# EAGLE schematic Control Board v0.1 (EAGLE 7.7.0)
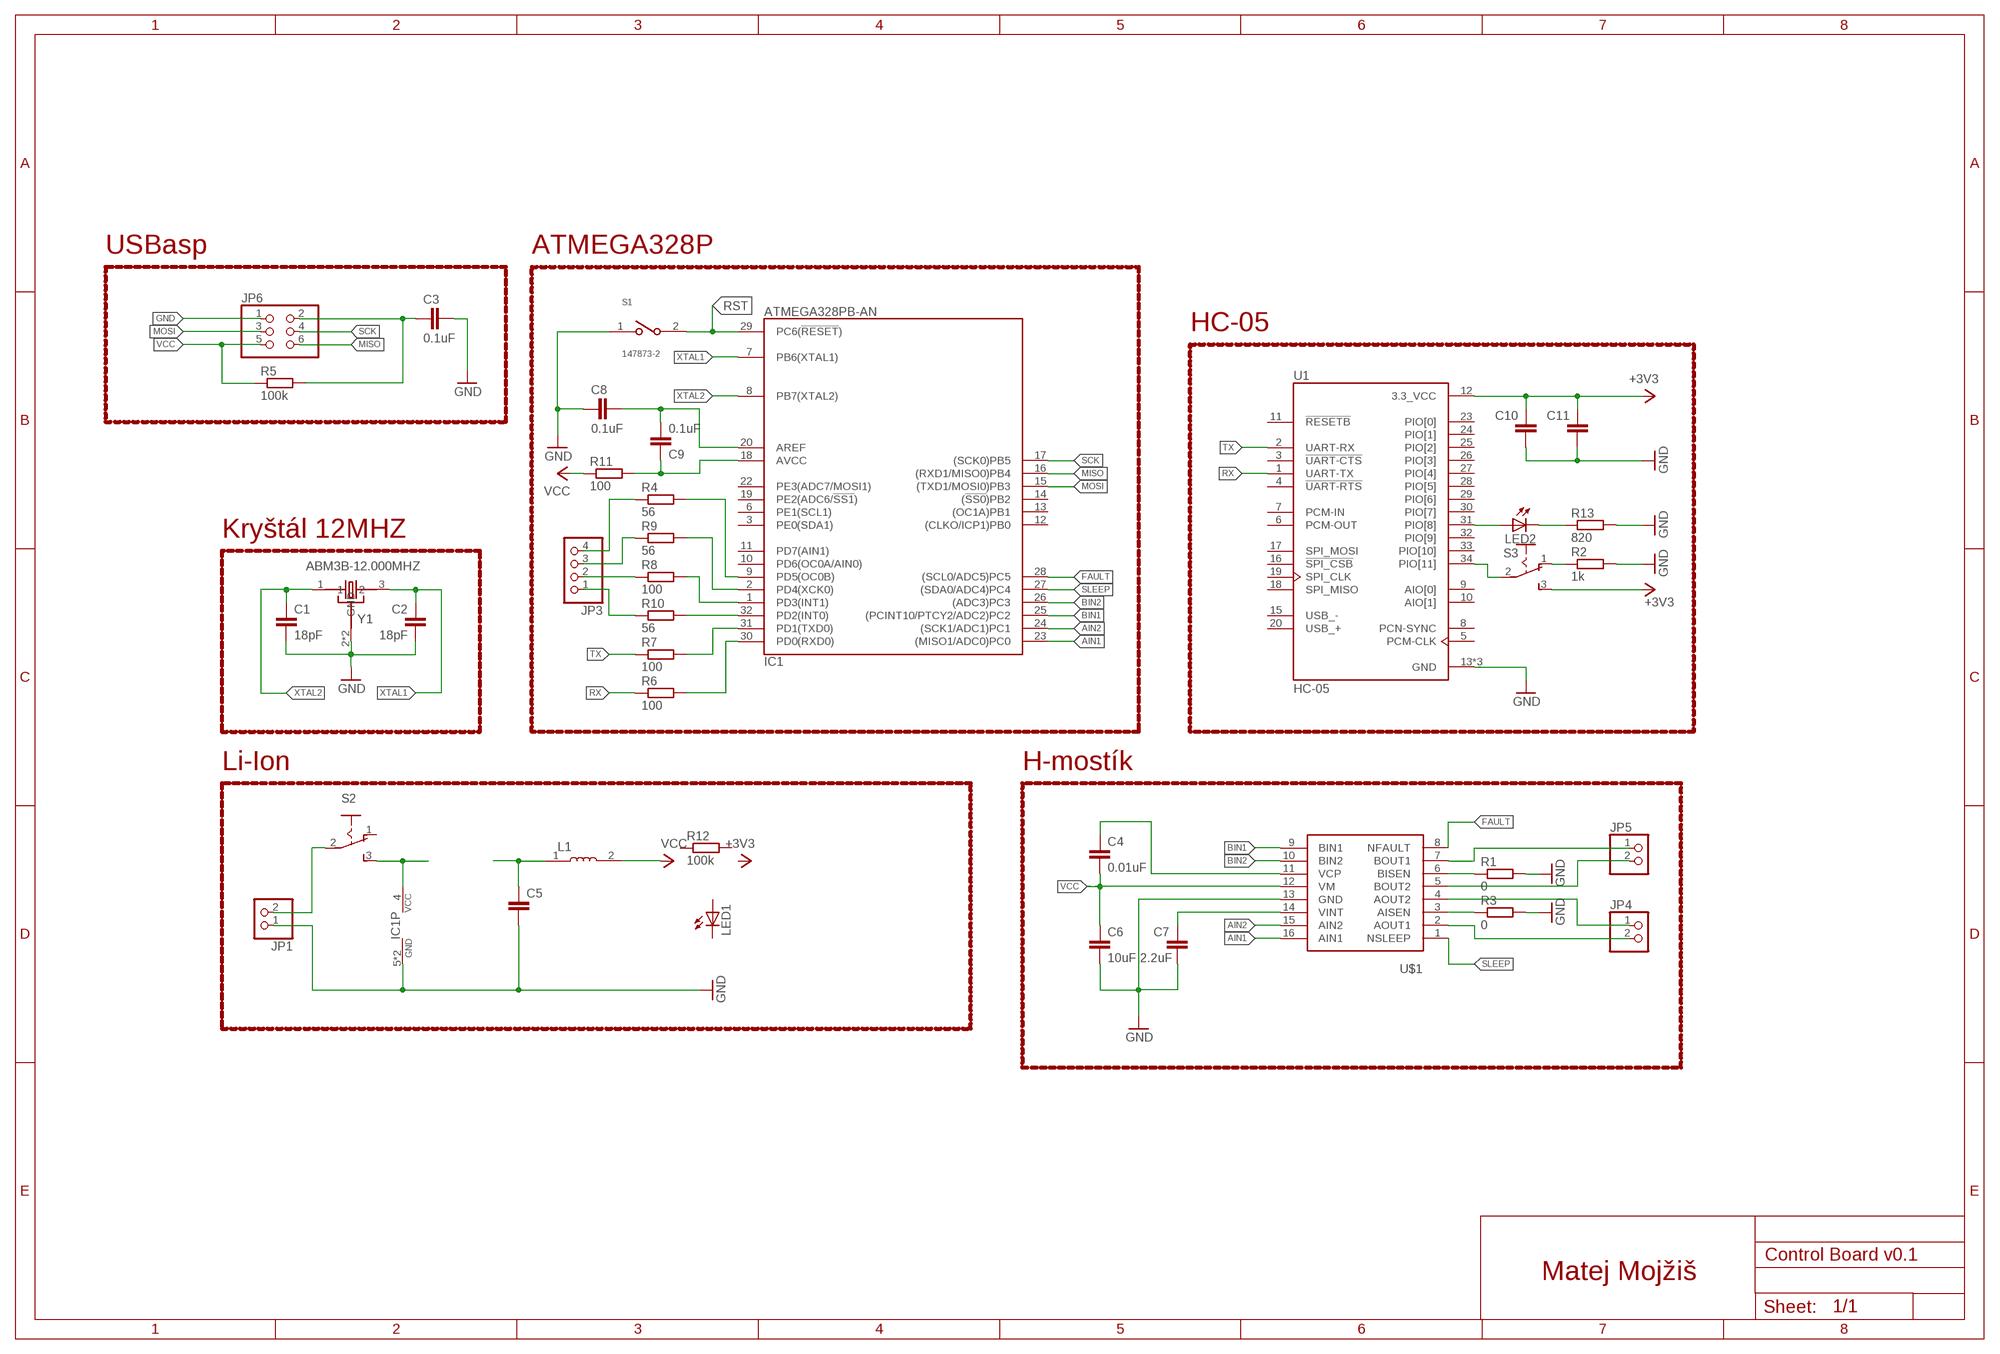
[diagram p0: schematic, sheet 1]

## Parts
C1  18pF  C-EUC0805  [C0805]
C2  18pF  C-EUC0805  [C0805]
C3  0.1uF  C-EUC0805  [C0805]
C4  0.01uF  C-EUC0805  [C0805]
C5  C-EUC0805  [C0805]
C6  10uF  C-EUC0805  [C0805]
C7  2.2uF  C-EUC0805  [C0805]
C8  0.1uF  C-EUC0805  [C0805]
C9  0.1uF  C-EUC0805  [C0805]
C10  C-EUC0805  [C0805]
C11  C-EUC0805  [C0805]
IC1  ATMEGA328PB-AN  [QFP32_7X7_0.80]
JP1  PINHD-1X2/90  [1X02/90]
JP3  PINHD-1X4  [1X04]
JP4  PINHD-1X2/90  [1X02/90]
JP5  PINHD-1X2/90  [1X02/90]
JP6  PINHD-2X3  [2X03]
L1  MLF2012C330KT000  [INDC2012X87N]
LED1  LEDCHIPLED_0805  [CHIPLED_0805]
LED2  LEDCHIPLED_0805  [CHIPLED_0805]
R1  0  R-EU_R0805  [R0805]
R2  1k  R-EU_R0805  [R0805]
R3  0  R-EU_R0805  [R0805]
R4  56  R-EU_R0805  [R0805]
R5  100k  R-EU_R0805  [R0805]
R6  100  R-EU_R0805  [R0805]
R7  100  R-EU_R0805  [R0805]
R8  100  R-EU_R0805  [R0805]
R9  56  R-EU_R0805  [R0805]
R10  56  R-EU_R0805  [R0805]
R11  100  R-EU_R0805  [R0805]
R12  100k  R-EU_R0805  [R0805]
R13  820  R-EU_R0805  [R0805]
S1  147873-2  [SW_147873-2]
S2  255SB  [255SB]
S3  M251  [M251]
U1  HC-05  [XCVR_HC-05]
U$1  DVR8833SUPERFICIAL  [PWP16]
Y1  ABM3B-12.000MHZ  ABM3B-8.000MHZ-B2-T  [OSCSC500X320X110-4N]

## Nets
+3V3: C10.1 C11.1 S3.3(S) U1.12(3.3_VCC)
AIN1: IC1.23((MISO1/ADC0)PC0) U$1.16(AIN1)
AIN2: IC1.24((SCK1/ADC1)PC1) U$1.15(AIN2)
BIN1: IC1.25((PCINT10/PTCY2/ADC2)PC2) U$1.9(BIN1)
BIN2: IC1.26((ADC3)PC3) U$1.10(BIN2)
FAULT: IC1.28((SCL0/ADC5)PC5) U$1.8(NFAULT)
GND: C1.2 C2.2 C3.1 C5.2 C6.2 C7.2 C8.2 C10.2 C11.2 IC1.5(GND) IC1.21(GND) JP1.1 JP6.1 R1.2 R2.2 R3.2 R13.2 S1.1 U1.13(GND) U1.21(GND) U1.22(GND) U$1.13(GND) Y1.2(GND) Y1.4(GND)
MISO: IC1.16((RXD1/MISO0)PB4) JP6.6
MOSI: IC1.15((TXD1/MOSI0)PB3) JP6.3
N$1: IC1.4(VCC) S2.3(S)
N$2: IC1.31(PD1(TXD0)) R7.2
N$3: JP1.2 S2.2(P)
N$4: JP5.1 U$1.7(BOUT1)
N$5: IC1.30(PD0(RXD0)) R6.2
N$6: IC1.32(PD2(INT0)) R10.2
N$7: JP5.2 U$1.5(BOUT2)
N$8: JP4.1 U$1.4(AOUT2)
N$9: JP4.2 U$1.2(AOUT1)
N$10: R1.1 U$1.6(BISEN)
N$11: R3.1 U$1.3(AISEN)
N$12: LED2.A U1.31(PIO[8])
N$13: C4.1 U$1.11(VCP)
N$14: LED2.C R13.1
N$15: C7.1 U$1.14(VINT)
N$18: IC1.1(PD3(INT1)) R8.2
N$19: S3.2(P) U1.34(PIO[11])
N$20: R2.1 S3.1(O)
N$21: C5.1 L1.1
N$22: IC1.2(PD4(XCK0)) R9.2
N$23: IC1.9(PD5(OC0B)) R4.2
N$24: JP3.4 R4.1
N$25: JP3.1 R10.1
N$26: JP3.2 R8.1
N$27: JP3.3 R9.1
N$28: C8.1 C9.2 IC1.20(AREF)
N$30: C9.1 IC1.18(AVCC) R11.2
RST: C3.2 IC1.29(PC6(!RESET!)) JP6.2 R5.2 S1.2
RX: R6.1 U1.1(UART-TX)
SCK: IC1.17((SCK0)PB5) JP6.4
SLEEP: IC1.27((SDA0/ADC4)PC4) U$1.1(NSLEEP)
TX: R7.1 U1.2(UART-RX)
VCC: C4.2 C6.1 JP6.5 L1.2 R5.1 R11.1 U$1.12(VM)
XTAL1: C2.1 IC1.7(PB6(XTAL1)) Y1.3
XTAL2: C1.1 IC1.8(PB7(XTAL2)) Y1.1
Unconnected: IC1.3(PE0(SDA1)) IC1.6(PE1(SCL1)) IC1.10(PD6(OC0A/AIN0)) IC1.11(PD7(AIN1)) IC1.12((CLKO/ICP1)PB0) IC1.13((OC1A)PB1) IC1.14((!SS0!)PB2) IC1.19(PE2(ADC6/!SS1!)) IC1.22(PE3(ADC7/MOSI1)) LED1.A LED1.C R12.1 R12.2 S2.1(O) U1.3(!UART-CTS) U1.4(!UART-RTS) U1.5(PCM-CLK) U1.6(PCM-OUT) U1.7(PCM-IN) U1.8(PCN-SYNC) U1.9(AIO[0]) U1.10(AIO[1]) U1.11(!RESETB) U1.15(USB_-) U1.16(!SPI_CSB) U1.17(SPI_MOSI) U1.18(SPI_MISO) U1.19(SPI_CLK) U1.20(USB_+) U1.23(PIO[0]) U1.24(PIO[1]) U1.25(PIO[2]) U1.26(PIO[3]) U1.27(PIO[4]) U1.28(PIO[5]) U1.29(PIO[6]) U1.30(PIO[7]) U1.32(PIO[9]) U1.33(PIO[10])

## Notes on the sheet
- USBasp | ATMEGA328P
- HC-05
- Kryštál 12MHZ
- Li-Ion | H-mostík
- Matej Mojžiš

## Library data of the parts
C1-C11 = rcl:C-EU: CAPACITOR, European symbol
IC1 = atmel328new:ATMEGA328PB: 8-bit AVR Microcontroller 32kbytes flash 2kbytes SRAM 1kbyte EEPROM USART 8-channel 10 bit ADC
JP1 JP4 JP5 = pinhead:PINHD-1X2: PIN HEADER
JP3 = pinhead:PINHD-1X4: PIN HEADER
JP6 = pinhead:PINHD-2X3: PIN HEADER
L1 = MLF2012C330KT000:MLF2012C330KT000: FIXED IND 33UH 5MA 1.1 OHM SMD Check prices <https://pricing.snapeda.com/parts/MLF2012C330KT000/TDK/view-part?ref=eda>; AVAILABILITY: Warning; DESCRIPTION: Fixed Ind 33uh 5ma 1.1 Ohm Smd; MF: TDK; MP: MLF2012C330KT000; PACKAGE: 0805 TDK; PRICE: None; PURCHASE-URL: https://pricing.snapeda.com/search/part/MLF2012C330KT000/?ref=eda
LED1 LED2 = led:LED: LED OSRAM: - CHIPLED LG R971, LG N971, LY N971, LG Q971, LY Q971, LO R971, LY R971 LH N974, LH R974 LS Q976, LO Q976, LY Q976 LO Q996 - Hyper CHIPLED LW Q18S LB Q993, LB Q99A, LB R99A - SideLED LS A670, LO A670, LY A670, LG A670, LP A670 LB A673, LV A673, LT A673, LW A673 LH A674 LY A675 LS A676, LA A676, LO A676, LY A676, LW A676 LS A679, LY A679, LG A679 - Hyper Micro SIDELED® LS Y876, LA Y876, LO Y876, LY Y876 LT Y87S - SmartLED LW L88C, LW L88S LB L89C, LB L89S, LG L890 LS L89K, LO L89K, LY L89K LS L896, LA L896, LO L896, LY L896 - TOPLED LS T670, LO T670, LY T670, LG T670, LP T670 LSG T670, LSP T670, LSY T670, LOP T670, LYG T670 LG T671, LOG T671, LSG T671 LB T673, LV T673, LT T673, LW T673 LH T674 LS T676, LA T676, LO T676, LY T676, LB T676, LH T676, LSB T676, LW T676 LB T67C, LV T67C, LT T67C, LS T67K, LO T67K, LY T67K, LW E67C LS E67B, LA E67B, LO E67B, LY E67B, LB E67C, LV E67C, LT E67C LW T67C LS T679, LY T679, LG T679 LS T770, LO T770, LY T770, LG T770, LP T770 LB T773, LV T773, LT T773, LW T773 LH T774 LS E675, LA E675, LY E675, LS T675 LS T776, LA T776, LO T776, LY T776, LB T776 LHGB T686 LT T68C, LB T68C - Hyper Mini TOPLED® LB M676 - Mini TOPLED Santana® LG M470 LS M47K, LO M47K, LY M47K Source: http://www.osram.convergy.de LUXEON: - LUMILED® LXK2-PW12-R00, LXK2-PW12-S00, LXK2-PW14-U00, LXK2-PW14-V00 LXK2-PM12-R00, LXK2-PM12-S00, LXK2-PM14-U00 LXK2-PE12-Q00, LXK2-PE12-R00, LXK2-PE12-S00, LXK2-PE14-T00, LXK2-PE14-U00 LXK2-PB12-K00, LXK2-PB12-L00, LXK2-PB12-M00, LXK2-PB14-N00, LXK2-PB14-P00, LXK2-PB14-Q00 LXK2-PR12-L00, LXK2-PR12-M00, LXK2-PR14-Q00, LXK2-PR14-R00 LXK2-PD12-Q00, LXK2-PD12-R00, LXK2-PD12-S00 LXK2-PH12-R00, LXK2-PH12-S00 LXK2-PL12-P00, LXK2-PL12-Q00, LXK2-PL12-R00 Source: www.luxeon.com KINGBRIGHT: KA-3528ASYC Source: www.kingbright.com
R1-R13 = rcl:R-EU_: RESISTOR, European symbol
S1 = 147873-2:147873-2: SWITCH TACTILE SPST-NO 0.05A 24V Check prices <https://pricing.snapeda.com/parts/147873-2/TE%20Connectivity/view-part?ref=eda>; AVAILABILITY: Good; COMMENT: 147873-2; CONFIGURATION_POLE-THROW: Single Pole - Single Throw; CONTACT_CURRENT_RATING: 50 mA; DESCRIPTION: Switch Tactile OFF (ON) SPST Rectangular Button J-Bend 0.05A 24VDC 1.77N SMD T/R; MF: TE Connectivity; MP: 147873-2; PACKAGE: None; PRICE: None; PURCHASE-URL: https://pricing.snapeda.com/search/part/147873-2/?ref=eda
S2 = switch:255SB: SLIDING SWITCH Distributor Buerklin, 11G810
S3 = switch:M251: SLIDING SWITCH Mors, distributor Buerklin, 11G702
U1 = HC-05:HC-05: Bluetooth to Serial Port Module; AVAILABILITY: Unavailable; DESCRIPTION: Bluetooth to Serial Port Module; MF: Bel Power solution; MP: HC-05; PACKAGE: SOIC-14; PRICE: None
U$1 = personales:DVR8833
Y1 = ABM3B-8.000MHZ-B2-T:ABM3B-8.000MHZ-B2-T: Crystal 8MHz ±20ppm (Tol) ±50ppm (Stability) 18pF FUND 200Ohm 4-Pin CSMD T/R Check prices <https://pricing.snapeda.com/parts/ABM3B-8.000MHZ-B2-T/Abracon/view-part?ref=eda>; AVAILABILITY: Good; DESCRIPTION: 8MHz ±20ppm Crystal 18pF 200 Ohms 4-SMD, No Lead; MF: Abracon; MP: ABM3B-8.000MHZ-B2-T; PACKAGE: SMD-4 Abracon; PRICE: None; PURCHASE-URL: https://pricing.snapeda.com/search/part/ABM3B-8.000MHZ-B2-T/?ref=eda